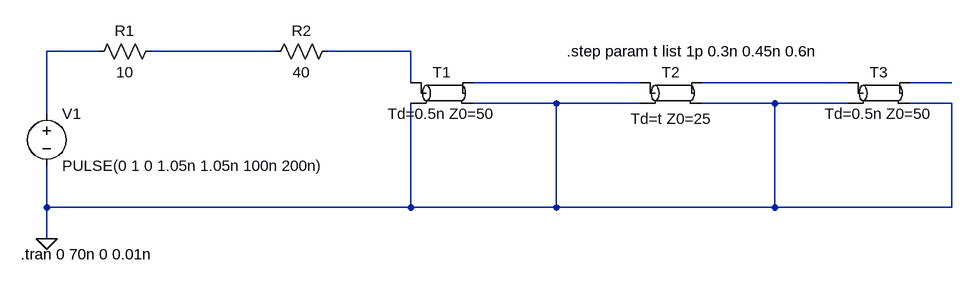
[diagram p0: schematic p19.asc]
p19.asc, the LTspice schematic file:
Version 4.1
SHEET 1 1684 680
WIRE 272 -16 192 -16
WIRE 544 -16 352 -16
WIRE 752 -16 624 -16
WIRE 752 32 752 -16
WIRE 1104 32 848 32
WIRE 1424 32 1200 32
WIRE 1584 32 1520 32
WIRE 976 64 848 64
WIRE 1104 64 976 64
WIRE 1312 64 1200 64
WIRE 1424 64 1312 64
WIRE 1584 64 1520 64
WIRE 192 80 192 -16
WIRE 192 224 192 160
WIRE 752 224 752 64
WIRE 752 224 192 224
WIRE 976 224 976 64
WIRE 976 224 752 224
WIRE 1312 224 1312 64
WIRE 1312 224 976 224
WIRE 1584 224 1584 64
WIRE 1584 224 1312 224
WIRE 192 272 192 224
FLAG 192 272 0
SYMBOL voltage 192 64 R0
WINDOW 123 0 0 Left 0
WINDOW 39 0 0 Left 0
SYMATTR InstName V1
SYMATTR Value PULSE(0 1 0 1.05n 1.05n 100n 200n)
SYMBOL tline 800 48 R0
SYMATTR InstName T1
SYMATTR Value Td=0.5n Z0=50
SYMBOL res 640 -32 R90
WINDOW 0 0 56 VBottom 2
WINDOW 3 32 56 VTop 2
SYMATTR InstName R2
SYMATTR Value 40
SYMBOL res 368 -32 R90
WINDOW 0 0 56 VBottom 2
WINDOW 3 32 56 VTop 2
SYMATTR InstName R1
SYMATTR Value 10
SYMBOL tline 1152 48 R0
WINDOW 3 1 24 Top 2
SYMATTR Value Td=t Z0=25
SYMATTR InstName T2
SYMBOL tline 1472 48 R0
SYMATTR InstName T3
SYMATTR Value Td=0.5n Z0=50
TEXT 152 296 Left 2 !.tran 0 70n 0 0.01n
TEXT 992 -16 Left 2 !.step param t list 1p 0.3n 0.45n 0.6n

The netlist it stands for:
* p19.asc
V1 N001 0 PULSE(0 1 0 1.05n 1.05n 100n 200n)
T1 N003 0 N004 0 Td=0.5n Z0=50
R2 N003 N002 40
R1 N002 N001 10
T2 N004 0 N005 0 Td=t Z0=25
T3 N005 0 N006 0 Td=0.5n Z0=50
.tran 0 70n 0 0.01n
.step param t list 1p 0.3n 0.45n 0.6n
.backanno
.end